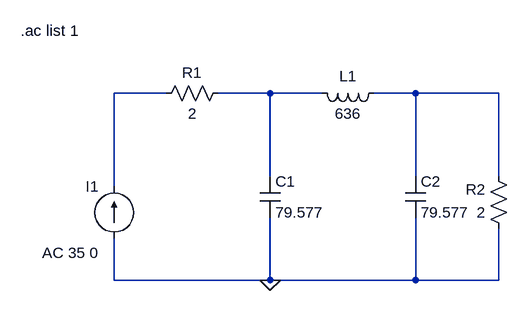
[diagram p0: schematic ch-13-prob-45.asc]
ch-13-prob-45.asc, the LTspice schematic file:
Version 4
SHEET 1 880 680
WIRE 288 224 208 224
WIRE 448 224 368 224
WIRE 528 224 448 224
WIRE 672 224 608 224
WIRE 800 224 672 224
WIRE 448 352 448 224
WIRE 672 352 672 224
WIRE 800 352 800 224
WIRE 208 368 208 224
WIRE 208 512 208 448
WIRE 448 512 448 416
WIRE 448 512 208 512
WIRE 672 512 672 416
WIRE 672 512 448 512
WIRE 800 512 800 432
WIRE 800 512 672 512
FLAG 448 512 0
SYMBOL current 208 448 R180
WINDOW 0 24 80 Left 2
WINDOW 3 24 0 Left 2
WINDOW 123 24 -22 Left 2
SYMATTR InstName I1
SYMATTR Value ""
SYMATTR Value2 AC 35 0
SYMBOL Res 384 208 R90
WINDOW 0 0 56 VBottom 2
WINDOW 3 32 56 VTop 2
SYMATTR InstName R1
SYMATTR Value 2
SYMBOL ind 624 208 R90
WINDOW 0 5 56 VBottom 2
WINDOW 3 32 56 VTop 2
SYMATTR InstName L1
SYMATTR Value 636
SYMBOL Res 816 448 R180
WINDOW 0 36 76 Left 2
WINDOW 3 36 40 Left 2
SYMATTR InstName R2
SYMATTR Value 2
SYMBOL Cap 432 352 R0
SYMATTR InstName C1
SYMATTR Value 79.577
SYMBOL Cap 656 352 R0
SYMATTR InstName C2
SYMATTR Value 79.577
SYMATTR SpiceLine Rser=-2
TEXT 64 128 Left 2 !.ac list 1

The netlist it stands for:
* ch-13-prob-45.asc
I1 0 N001 AC 35 0
R1 N002 N001 2
L1 N003 N002 636
R2 0 N003 2
C1 N002 0 79.577
C2 N003 0 79.577 Rser=-2
.ac list 1
.backanno
.end